# EAGLE design feu_35 (EAGLE 6.3)
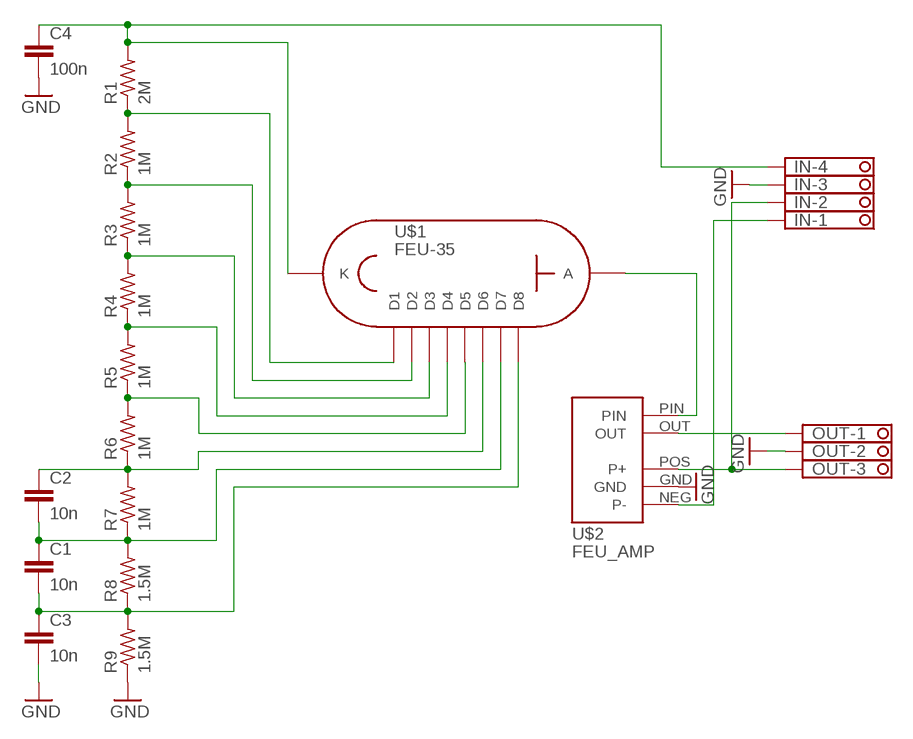
[diagram p0: schematic, sheet 1]

## Parts
C1  10n  C-EU075-032X103  [C075-032X103]
C2  10n  C-EU075-032X103  [C075-032X103]
C3  10n  C-EU075-032X103  [C075-032X103]
C4  100n  C-EU225-087X268  [C225-087X268]
IN  1751264  [1751264]
OUT  1751251  [1751251]
R1  2M  R-US_0207/2V  [0207/2V]
R2  1M  R-US_0207/2V  [0207/2V]
R3  1M  R-US_0207/2V  [0207/2V]
R4  1M  R-US_0207/2V  [0207/2V]
R5  1M  R-US_0207/2V  [0207/2V]
R6  1M  R-US_0207/2V  [0207/2V]
R7  1M  R-US_0207/2V  [0207/2V]
R8  1.5M  R-US_0207/2V  [0207/2V]
R9  1.5M  R-US_0207/2V  [0207/2V]
U$1  FEU-35  [PANEL_10]
U$2  FEU_AMP  [FEU_AMP]

## Nets
GND: C3.2 C4.2 IN.3 OUT.2 R9.1 U$2.GND
N$1: R1.1 R2.2 U$1.P$2(D1)
N$2: R3.1 R4.2 U$1.P$4(D3)
N$3: R4.1 R5.2 U$1.P$5(D4)
N$4: R5.1 R6.2 U$1.P$6(D5)
N$5: C2.1 R6.1 R7.2 U$1.P$7(D6)
N$6: U$1.P$10(A) U$2.PIN
N$7: OUT.1 U$2.OUT
N$8: IN.2 OUT.3 U$2.POS(P+)
N$9: IN.1 U$2.NEG(P-)
N$11: R2.1 R3.2 U$1.P$3(D2)
N$12: C4.1 IN.4 R1.2 U$1.P$1(K)
N$13: C1.2 C3.1 R8.1 R9.2 U$1.P$9(D8)
N$14: C1.1 C2.2 R7.1 R8.2 U$1.P$8(D7)

## Library data of the parts
C1-C4 = resistor:C-EU: CAPACITOR, European symbol
IN = con-phoenix-350:1751264: MKDS 1/ 4-3,5 Printklemme Nennstrom: 10 A Bemessungsspannung: 160 V Raster: 3,5 mm Polzahl: 4 Montageart: Löten Anschlussart: Schraubanschluss Anschlussrichtung vom Leiter zur Platine: 0° Source: http://eshop.phoenixcontact.com .. 1751264.pdf; MPN: 1751264; OC_FARNELL: unknown; OC_NEWARK: 10R0934
OUT = con-phoenix-350:1751251: MKDS 1/ 3-3,5 Printklemme Nennstrom: 10 A Bemessungsspannung: 160 V Raster: 3,5 mm Polzahl: 3 Montageart: Löten Anschlussart: Schraubanschluss Anschlussrichtung vom Leiter zur Platine: 0° Source: http://eshop.phoenixcontact.com .. 1751251.pdf; OC_FARNELL: unknown; OC_NEWARK: unknown
R1-R9 = resistor:R-US_: RESISTOR, American symbol
U$1 = pmt:FEU-35: FEU-35
U$2 = pwr:FEU_AMP: FEU amplifier

## Board
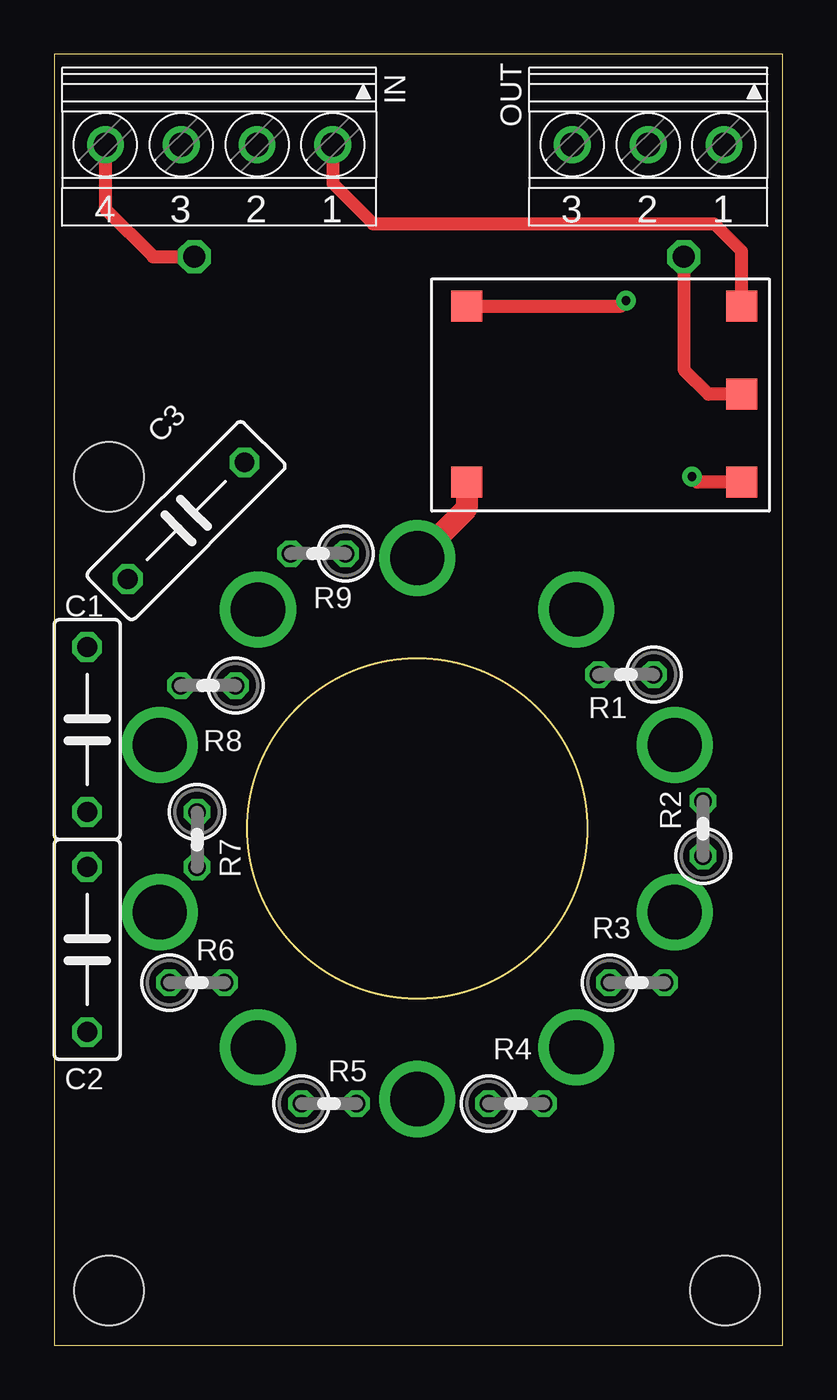
[diagram p1: board, top side]
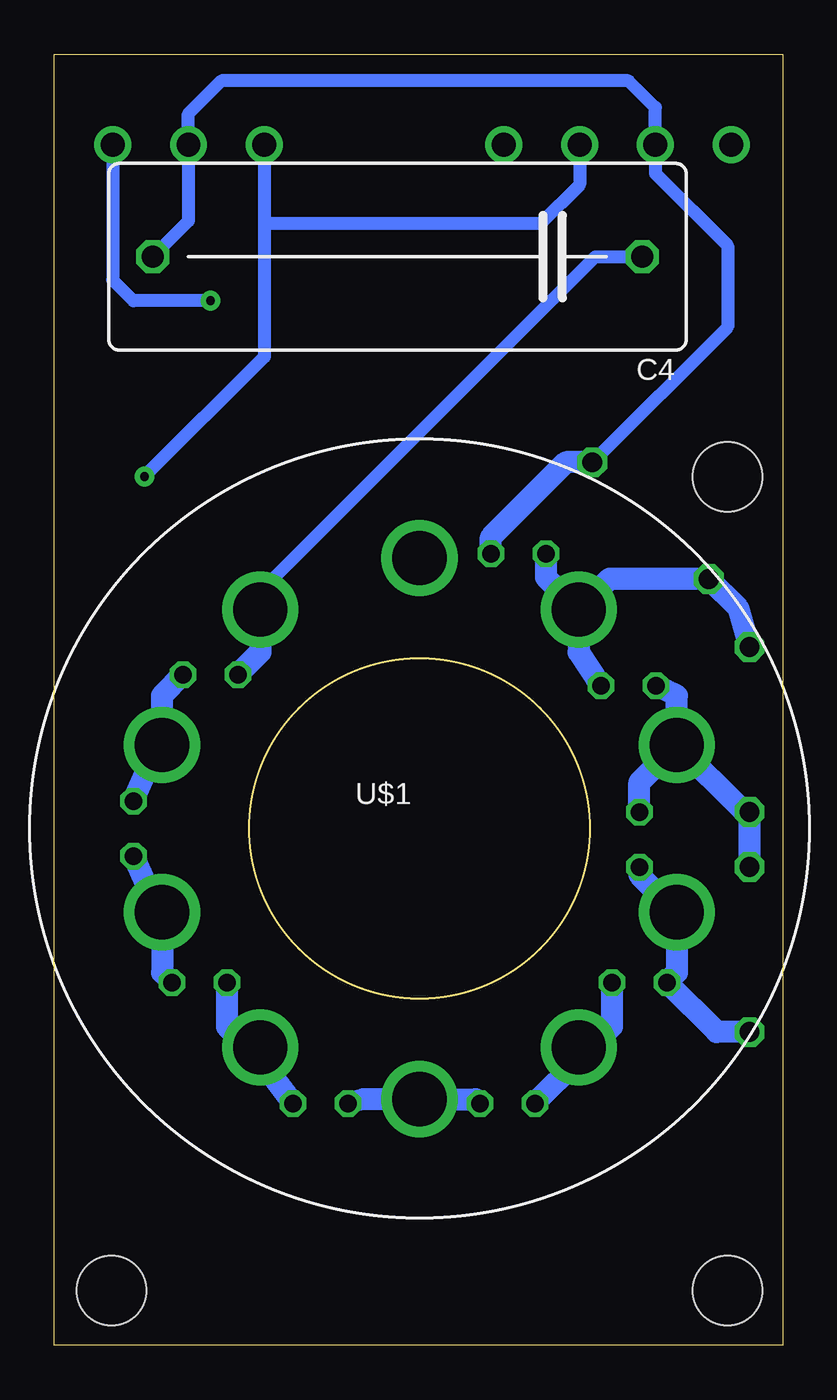
[diagram p2: board, bottom side, seen from below]

Size 33.64 x 59.65 mm. Coordinates in mm from the lower left corner, seen from the top.
Outline: 0,0 33.64,0 33.64,59.65 0,59.65 0,0
Outline: circle at 16.76,23.88 radius 7.85
Copper layers (1*16): Top 0.035mm / dielectric 1.5mm / Bottom 0.035mm
Design rules "PCBCart-proto": minimum track width 5mil, minimum drill 0.2mm, track to track 6mil, track to pad 6mil, pad to pad 6mil, via to via 6mil, smd to smd 5mil, copper to edge 20mil, drill to drill 8mil, minimum pad ring 8mil, minimum via ring 10mil, stop-mask expansion 3mil, vias tented up to drill 0mil, thermal gap 8mil
Holes 3.2 mm at 2.54,2.54 30.99,2.54 2.54,40.13

### Footprints (pad centres in the part's own frame; a part is rotated, then mirrored left to right if it is on the bottom)
C075-032X103 = drill 0.914 octagon: 1 -3.81,0; 2 3.81,0
C225-087X268 = drill 1.016 octagon: 1 -11.303,0; 2 11.303,0
1751264 = drill 1.1 pad 1.7: 1 -5.25,-0.1; 2 -1.75,-0.1; 3 1.75,-0.1; 4 5.25,-0.1
1751251 = drill 1.1 pad 1.7: 1 -3.5,-0.1; 2 0,-0.1; 3 3.5,-0.1
0207/2V = drill 0.813 octagon: 1 -1.27,0; 2 1.27,0
PANEL_10 = drill 2.5: P$1 -7.347,10.113; P$2 -11.888,3.863; P$3 -11.888,-3.863; P$4 -7.347,-10.113; P$5 0,-12.5; P$6 7.347,-10.113; P$7 11.888,-3.863; P$8 11.888,3.863; P$9 7.347,10.113; P$10 0,12.5
FEU_AMP = smd 1.422 x 1.422: GND -6.35,0.254; NEG -6.35,-3.81; OUT 6.35,-3.81; PIN 6.35,4.318; POS -6.35,4.318

### Placement (x,y rotation side)
C1  1.52,28.45 90 top
C2  1.52,18.29 90 top
C3  6.1,38.1 45 top
C4  17.78,50.29 180 bottom
IN  7.62,55.37 180 top
OUT  27.43,55.37 180 top
R1  26.42,30.99 180 top
R2  29.97,23.88 90 top
R3  26.92,16.76 0 top
R4  21.34,11.18 0 top
R5  12.7,11.18 0 top
R6  6.6,16.76 0 top
R7  6.6,23.37 270 top
R8  7.11,30.48 180 top
R9  12.19,36.58 180 top
U$1  16.76,23.88 0 bottom
U$2  25.4,44.2 180 top

### Tracks (layer width: path | path; a pad name or v marks a point on that pad's centre or on a via)
GND
  Top 0.61: U$2.GND 30.23,43.94 29.08,45.09 C4.2
  Bottom 0.61: C4.2 27.43,51.94 OUT.2 27.43,56.9 25.91,58.42 7.11,58.42 5.87,57.18 IN.3 5.87,54.13 2.54,50.8 2.54,47.04 C3.2
  Bottom 1.016: R9.1 13.46,37.34 10.01,40.79 C3.2
N$1
  Bottom 1.016: R2.2 28.96,27.43 U$1.P$2 28.65,30.02 R1.1
N$2
  Bottom 1.016: U$1.P$4 24.11,13.19 | 24.11,13.19 R4.2 | R3.1 25.65,14.73 24.11,13.19
N$3
  Bottom 1.016: R5.2 14.17,11.38 U$1.P$5 19.36,11.38 R4.1
N$4
  Bottom 1.016: U$1.P$6 9.42,13.19 | 9.42,13.19 R5.1 | R6.2 7.87,14.73 9.42,13.19
N$5
  Bottom 1.016: U$1.P$7 4.88,17.22 R6.1 3.05,14.48 C2.1 | 4.82,20.07 U$1.P$7 | R7.2 6.6,21.74 U$1.P$7
N$6
  Top 1.016: U$2.PIN 19.05,38.66 U$1.P$10
N$7  (via drill 0.4)
  Top 0.61: U$2.OUT 26.16,48.01 v26.42,48.26
  Bottom 0.61: v26.42,48.26 29.97,48.26 30.93,49.22 OUT.1
N$8  (via drill 0.4)
  Top 0.61: U$2.POS 29.72,39.88 v29.46,40.13
  Bottom 0.61: v29.46,40.13 23.93,45.66 23.93,51.82 | OUT.3 23.93,51.82 | IN.2 9.37,53.62 11.18,51.82 23.93,51.82
N$9
  Top 0.61: IN.1 12.87,53.68 14.73,51.82 30.48,51.82 31.75,50.55 U$2.NEG
N$11
  Bottom 1.016: R3.2 28.65,17.22 U$1.P$3 28.96,20.32 R2.1
N$12
  Top 0.61: IN.4 2.37,52.49 4.57,50.29 C4.1
  Bottom 0.61: U$1.P$1 24.11,34.82 8.64,50.29 C4.1
  Bottom 1.016: U$1.P$1 24.11,32.02 R1.2
N$13
  Bottom 1.016: U$1.P$9 9.42,32.02 R8.1 | R9.2 10.92,35.49 U$1.P$9 | U$1.P$9 8,35.41 C3.1 2.03,34.04 C1.2
N$14
  Bottom 1.016: U$1.P$8 4.88,30.02 R8.2 | 4.82,27.69 U$1.P$8 | C2.2 C1.1 1.77,24.64 U$1.P$8 | R7.1 6.6,26.01 U$1.P$8